# Altium schematic sheet DSD_Aerobits_RPI4_OLED.SchDoc
size A4; SheetNumber: 1; SheetTotal: 3
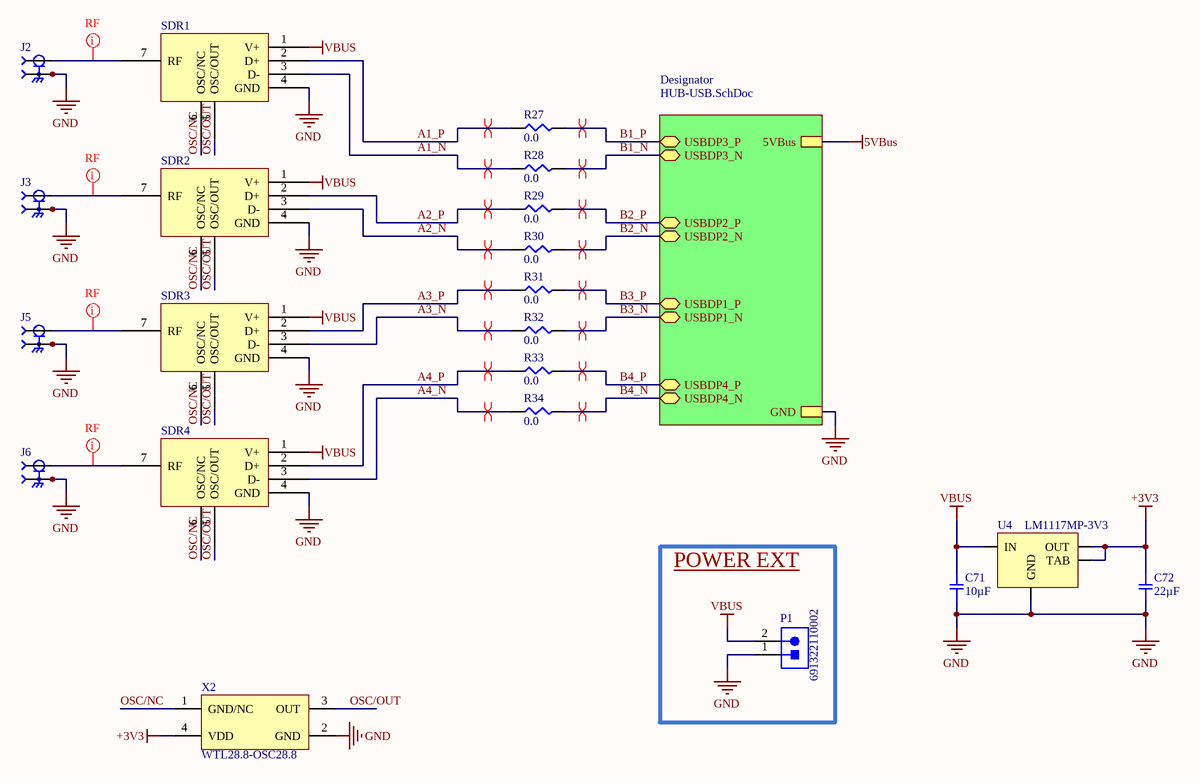
[diagram p0: DSD_Aerobits_RPI4_OLED.SchDoc]

## Parts
C71  10µF  [SMD-0805C]
C72  22µF  [SMD-0805C]
J2  CON-SMA-EDGE-S  [RFSOLUTIONS_CON-SMA-EDGE-S]  (value not drawn)
J3  CON-SMA-EDGE-S  [RFSOLUTIONS_CON-SMA-EDGE-S]  (value not drawn)
J5  CON-SMA-EDGE-S  [RFSOLUTIONS_CON-SMA-EDGE-S]  (value not drawn)
J6  CON-SMA-EDGE-S  [RFSOLUTIONS_CON-SMA-EDGE-S]  (value not drawn)
P1  691322110002  [691322110002]
R27  0.0  [SMD-0603-RES]
R28  0.0  [SMD-0603-RES]
R29  0.0  [SMD-0603-RES]
R30  0.0  [SMD-0603-RES]
R31  0.0  [SMD-0603-RES]
R32  0.0  [SMD-0603-RES]
R33  0.0  [SMD-0603-RES]
R34  0.0  [SMD-0603-RES]
SDR1  SDR_Module  [SDR]  (value not drawn)
SDR2  SDR_Module  [SDR]  (value not drawn)
SDR3  SDR_Module  [SDR]  (value not drawn)
SDR4  SDR_Module  [SDR]  (value not drawn)
U4  LM1117MP-3V3  [SOT223]
X2  WTL28.8-OSC28.8  [WTL28.8-OSC28.8]

## Blocks framed on the sheet
POWER EXT: P1

## Sub-sheets
Designator = HUB-USB.SchDoc: USBDP1_N (bidir), USBDP1_P (bidir), USBDP2_N (bidir), USBDP2_P (bidir), USBDP3_N (bidir), USBDP3_P (bidir), USBDP4_N (bidir), USBDP4_P (bidir), GND, 5VBus

## Nets
5VBus: sheet Designator/5VBus
+3V3: C72.2 U4.2(OUT) U4.4(TAB) X2.4(VDD)
GND: C71.1 C72.1 J2.G1 J2.G2 J2.G3 J2.G4 J3.G1 J3.G2 J3.G3 J3.G4 J5.G1 J5.G2 J5.G3 J5.G4 J6.G1 J6.G2 J6.G3 J6.G4 P1.1 SDR1.4(GND) SDR2.4(GND) SDR3.4(GND) SDR4.4(GND) U4.1(GND) X2.2(GND) ; sheet Designator/GND
VBUS: C71.2 P1.2 SDR1.1(V+) SDR2.1(V+) SDR3.1(V+) SDR4.1(V+) U4.3(IN)
A1_N: R28.1 SDR1.3(D-)
A1_P: R27.1 SDR1.2(D+)
A2_N: R30.1 SDR2.3(D-)
A2_P: R29.1 SDR2.2(D+)
A3_N: R32.1 SDR3.3(D-)
A3_P: R31.1 SDR3.2(D+)
A4_N: R34.1 SDR4.3(D-)
A4_P: R33.1 SDR4.2(D+)
B1_N: R28.2 ; sheet Designator/USBDP3_N
B1_P: R27.2 ; sheet Designator/USBDP3_P
B2_N: R30.2 ; sheet Designator/USBDP2_N
B2_P: R29.2 ; sheet Designator/USBDP2_P
B3_N: R32.2 ; sheet Designator/USBDP1_N
B3_P: R31.2 ; sheet Designator/USBDP1_P
B4_N: R34.2 ; sheet Designator/USBDP4_N
B4_P: R33.2 ; sheet Designator/USBDP4_P
OSC/NC: SDR1.6(OSC/NC) SDR2.6(OSC/NC) SDR3.6(OSC/NC) SDR4.6(OSC/NC) X2.1(GND/NC)
OSC/OUT: SDR1.5(OSC/OUT) SDR2.5(OSC/OUT) SDR3.5(OSC/OUT) SDR4.5(OSC/OUT) X2.3(OUT)
NetJ2_1: J2.1 SDR1.7(RF)
NetJ3_1: J3.1 SDR2.7(RF)
NetJ5_1: J5.1 SDR3.7(RF)
NetJ6_1: J6.1 SDR4.7(RF)

## Layout directives
differential pair: A1_N, A1_P, A2_N, A2_P, A3_N, A3_P, A4_N, A4_P, B1_N, B1_P, B2_N, B2_P, B3_N, B3_P, B4_N, B4_P
net class RF: NetJ2_1, NetJ3_1, NetJ5_1, NetJ6_1

## Library data of the parts
C71 = GRT21BC81C106KE01L: CAP CER 10UF 16V X6S 0805; Manufacturer: Murata Electronics North America; Factory Stock: 0; Unit Price (USD): 0,54; Minimum Quantity: 1; Tolerance: ±10%; Part Number: GRT21BC81C106KE01L; Datasheets: http://search.murata.co.jp/Ceramy/image/img/A01X/G101/ENG/GRT21BC81C106KE01-01.pdf; Image: //media.digikey.com/Renders/Murata%20Renders/GRT%20Series%200805(2012%20Metric).jpg; Digi-Key Part Number: 490-12343-1-ND; Quantity Available: 4300; @ qty: 0; Packaging: Cut Tape (CT); Series: GRT; Part Status: Active; Value: 10µF; Voltage: 16V; Temperature Coefficient: X6S; Operating Temperature: -55°C ~ 105°C; Features: Derating Recommended; Ratings: AEC-Q200; Applications: Automotive; Mounting Type: Surface Mount, MLCC; Package / Case: 0805 (2012 Metric); Size / Dimension: 0.079" L x 0.049" W (2.00mm x 1.25mm); Height - Seated (Max): -; Thickness (Max): 0.057" (1.45mm); Lead Spacing: -; Lead Style: -
C72 = GRT21BR61C226ME13L: CAP CER 22UF 16V X5R 0805; Manufacturer: Murata Electronics North America; Factory Stock: 0; Unit Price (USD): 0,58; Minimum Quantity: 1; Tolerance: ±20%; Part Number: GRT21BR61C226ME13L; Datasheets: http://search.murata.co.jp/Ceramy/image/img/A01X/G101/ENG/GRT21BR61C226ME13-01.pdf; Image: //media.digikey.com/Renders/Murata%20Renders/GRT%20Series%200805(2012%20Metric).jpg; Digi-Key Part Number: 490-12383-1-ND; Quantity Available: 32; @ qty: 0; Packaging: Cut Tape (CT); Series: GRT; Part Status: Active; Value: 22µF; Voltage: 16V; Temperature Coefficient: X5R; Operating Temperature: -55°C ~ 85°C; Features: -; Ratings: AEC-Q200; Applications: Automotive; Mounting Type: Surface Mount, MLCC; Package / Case: 0805 (2012 Metric); Size / Dimension: 0.079" L x 0.049" W (2.00mm x 1.25mm); Height - Seated (Max): -; Thickness (Max): 0.057" (1.45mm); Lead Spacing: -; Lead Style: -
J2 J3 J5 J6 = CON-SMA-EDGE-S: SMA Connector Jack, Female Socket - Board Edge, End Launch Solder; MF: RF Solutions; Value: *; SnapEDA_Link: https://www.snapeda.com/parts/CON-SMA-EDGE-S/RF+Solutions/view-part/?ref=snap; Purchase-URL: https://pricing.snapeda.com/search/part/CON-SMA-EDGE-S/?ref=eda; Check_prices: https://www.snapeda.com/parts/CON-SMA-EDGE-S/RF+Solutions/view-part/?ref=eda; Digi-Key_Part_Number: CON-SMA-EDGE-S-ND; Package: None; MP: CON-SMA-EDGE-S
P1 = 691322110002: WR-TBL Serie 3221 Horizontal PCB Header, Pluggable, THT, pitch 3.5mm, 2p; Manufacturer: Wurth Elektronik; Modularity: No; Pin Number: 2; Rated Current [UL]: 10A; Working Voltage [UL]: 300VAC; ComponentLink1Description: Manufacturer; ComponentLink1URL: http://www.we-online.de; ComponentLink2URL: https://katalog.we-online.de/em/datasheet/691322110002.pdf; ComponentLink2Description: Datasheet; Mounting Technology: THT; Manufacturer Part Number: 691322110002; Packaging: Box; Operating Temperature: -40 to +105degC; PCB/Cable/Panel: PCB; Pitch: 3.5mm; Published Date: Feburary 2021; Type: Horizontal; Application: Pluggable
R27-R34 = ERJ-3GEY0R00V: RES SMD 0.0OHM JUMPER 1/10W 0603; Manufacturer: Panasonic Electronic Components; Factory Stock: 0; Unit Price (USD): 0.00352; @ qty: 1500; Minimum Quantity: 1; Power (Watts): 0.1W, 1/10W; Part Number: ERJ-3GEY0R00V; Datasheets: http://industrial.panasonic.com/www-cgi/jvcr13pz.cgi?E+PZ+3+AOA0001+ERJ3GEY0R00V+7+WW; Image: //media.digikey.com/Photos/Panasonic%20Photos/MFG_ERJ-P6W%20Series.jpg; Digi-Key Part Number: P0.0GCT-ND; Quantity Available: 4813372; Packaging: Cut Tape (CT); Series: ERJ; Part Status: Active; Value: 0.0; Tolerance: Jumper; Composition: Thick Film; Features: Automotive AEC-Q200; Temperature Coefficient: -; Operating Temperature: -55°C ~ 155°C; Package / Case: 0603 (1608 Metric); Supplier Device Package: 0603; Size / Dimension: 0.063" L x 0.031" W (1.60mm x 0.80mm); Height - Seated (Max): 0.022" (0.55mm); Number of Terminations: 2; Failure Rate: -
U4 = LM1117MP-3V3: 800mA Low-Dropout Linear Regulator; PartNumber: LM1117MP-3.3; Manufacturer: National Semiconductor; CompType: LDO IC; PackageTopMarking: XYTT*N05A; PowerWise: N; Published: 4-Dec-2008; DatasheetVersion: Apr-2006; PackageVersion: revB, Apr-2003; PackageReference: MP04A; Publisher: Altium Limited; PackageDescription: Molded SOT-223, 6.50 x 3.56 x 1.6mm Body, 4 Lead, 2.3mm Pitch; RoHS: O; PinCount: 4; DigiKeyPartNumber: LM1117MP-3.3CT-ND; Code_JEDEC: TO-261-AA; Code_IPC: SOT223-4; ComponentLink1Description: LM1117 Datasheet; ComponentLink1URL: http://www.national.com/ds/LM/LM1117.pdf; ComponentLink2Description: LM1117 Web Page; ComponentLink2URL: http://www.national.com/pf/LM/LM1117.html; ComponentLink3Description: MP04A Package Page; ComponentLink3URL: http://www.national.com/packaging/folders/mp04a.html